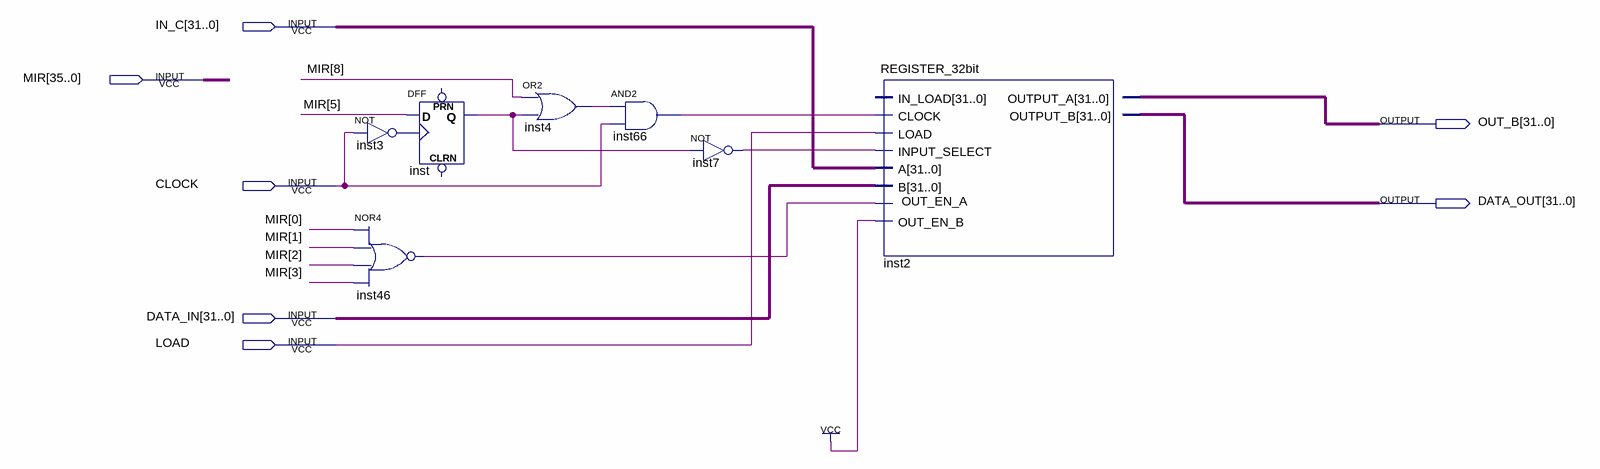
[diagram p0: schematic sheet]
// Quartus schematic MDR2.bdf as structural Verilog: 7 symbols, 7 pins
module MDR2 (
  input  [31:0] IN_C,
  input  [35:0] MIR,
  input  CLOCK,
  input  [31:0] DATA_IN,
  input  LOAD,
  output [31:0] OUT_B,
  output [31:0] DATA_OUT
);

  wire inst3_out, inst4_out, inst7_out, inst46_out, inst66_out, inst_q;

  DFF inst (.CLK(inst3_out), .D(MIR[5]), .Q(inst_q));  // open: CLRN, PRN
  not inst3 (inst3_out, CLOCK);
  nor inst46 (inst46_out, MIR[0], MIR[1], MIR[2], MIR[3]);
  or inst4 (inst4_out, MIR[8], inst_q);
  and inst66 (inst66_out, inst4_out, CLOCK);
  not inst7 (inst7_out, inst_q);
  REGISTER_32bit inst2 (
    .LOAD(LOAD), .OUT_EN_A(inst46_out), .CLOCK(inst66_out), .OUT_EN_B(1'b1), .INPUT_SELECT(inst7_out),
    .A(IN_C), .B(DATA_IN), .OUTPUT_A(OUT_B), .OUTPUT_B(DATA_OUT));  // open: IN_LOAD
endmodule
